# Altium schematic sheet Power.SchDoc
size A
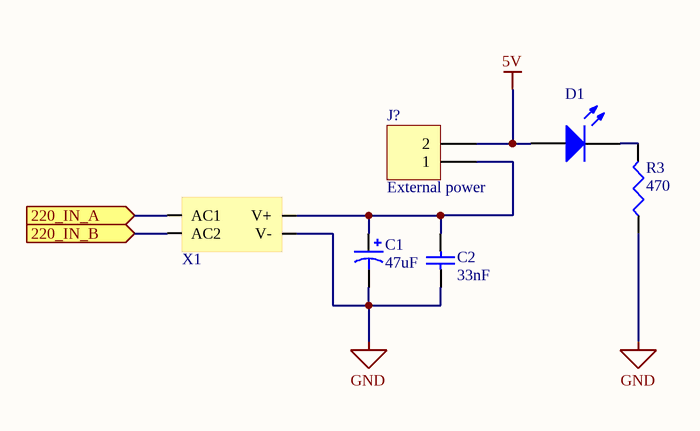
[diagram p0: Power.SchDoc]

## Parts
C1  value 47uF  [CAP47U]  (hidden comment: Cap Pol1)
C2  value 33nF  [C0805]  (hidden comment: Cap)
D1  LED2  [3.2X1.6X1.1]  (value not drawn)
J?  External power  [HEADER2]
R3  value 470  [J1-0603]  (hidden comment: Res3)
X1  AC/DC  [HLK-PM01]  (value not drawn)

## Ports
220_IN_A (in), 220_IN_B (in)

## Nets
5V: D1.1(A) J?.2
GND: C1.2 C2.1 R3.1 X1.3(V-)
220_IN_A: X1.1(AC1) ; port 220_IN_A
220_IN_B: X1.2(AC2) ; port 220_IN_B
NetC1_1: C1.1 C2.2 J?.1 X1.4(V+)
NetD1_2: D1.2(K) R3.2

## Library data of the parts
C1 = Cap Pol1: Polarized Capacitor (Radial); Manufacturer 1: Nichicon; Manufacturer Part Number 1: UWT1E470MCL6GS; Description 1: Aluminum Electrolytic Capacitors - SMD 25volts 47uF 6.3x5.8 20%; Dielectric Material: Aluminium; Voltage Rating: 25V; Tolerance: 20%; Ripple Current: 59mA; Leakage Current: 3uA; Life (Hours): 1000Hour; Dissipation Factor: 0.16%; Published: 8-Jun-2000; LatestRevisionDate: 17-Jul-2002; LatestRevisionNote: Re-released for DXP Platform.; PackageReference: RB7.6-15; Publisher: Altium Limited; PackageDescription: Polarized Capacitor (Radial); 2 Leads; Supplier 1: Digi-Key; Supplier Part Number 1: 493-9881-6-ND; Stock: 12722; Pricing 1: 1=0.29, 10=0.202, 100=0.1143, 500=0.08072 (USD); Mount: Surface Mount; Case/Package: Radial; Min Operating Temperature: -55°C; Max Operating Temperature: 105°C; Capacitance: 47uF; Package Quantity: 1000; Voltage Rating (DC): 25V; Packaging: Tape and Reel; Termination: SMD/SMT; Features: General Purpose; Diameter: 6.3mm; Length: 5.8mm; Height: 6.6mm; Radiation Hardening: No; Lead Free: Lead Free; ComponentLink1URL: http://www.mouser.com/ds/2/293/e-wt-30307.pdf?src-supplier=Mouser; ComponentLink1Description: http://www.mouser.com/ds/2/293/e-wt-30307.pdf?src-supplier=Mouser; ComponentLink2URL: https://www.verical.com/server-webapp/html/getDatasheet?partID=732041&src-supplier=Verical; ComponentLink2Description: https://www.verical.com/server-webapp/html/getDatasheet?partID=732041&src-supplier=Verical; ComponentLink3URL: http://www.nichicon.co.jp/english/products/pdfs/e-ch_ref.pdf?src-supplier=Digi-Key; ComponentLink3Description: http://www.nichicon.co.jp/english/products/pdfs/e-ch_ref.pdf?src-supplier=Digi-Key; ComponentLink4URL: http://nichicon-us.com/english/products/pdfs/e-wt.pdf?src-supplier=Future+Electronics; ComponentLink4Description: http://nichicon-us.com/english/products/pdfs/e-wt.pdf?src-supplier=Future+Electronics; ComponentLink5URL: http://www.nichicon.co.jp/english/products/pdfs/e-wt.pdf?src-supplier=Avnet+Europe; ComponentLink5Description: http://www.nichicon.co.jp/english/products/pdfs/e-wt.pdf?src-supplier=Avnet+Europe
C2 = Cap: Capacitor; Manufacturer 1: KEMET; Manufacturer Part Number 1: C0805C333K5RACTU; Description 1: KEMET - C0805C333K5RACTU - SMD Multilayer Ceramic Capacitor, 33000 pF, 50 V, 0805 [2012 Metric], ± 10%, X7R, C Series KEMET; Dielectric Material: Ceramic; Tolerance: 10%; Dielectric: X7R; Voltage Rating (DC): 50V; Published: 8-Jun-2000; LatestRevisionDate: 17-Jul-2002; LatestRevisionNote: Re-released for DXP Platform.; PackageReference: RAD-0.3; Publisher: Altium Limited; PackageDescription: Radial Cap, Thru-Hole; 2 Leads; 0.3 in Pin Spacing; Supplier 1: Digi-Key; Supplier Part Number 1: 399-1165-6-ND; Stock: 116403; Pricing 1: 1=0.12, 10=0.087, 100=0.0407, 500=0.02856, 1000=0.02364 (USD); Mount: Surface Mount; Case/Package: 0805; Min Operating Temperature: -55°C; Max Operating Temperature: 125°C; Capacitance: 33nF; Packaging: Tape and Reel; Voltage: 50V; Termination: SMD/SMT; Length: 2mm; Height: 0.78mm; Depth: 1.25mm; Radiation Hardening: No; ComponentLink1URL: http://www.kemet.com/kemet/web/homepage/kechome.nsf/vapubfiles/KEM_C1002_X7R_SMD.pdf/$file/KEM_C1002_X7R_SMD.pdf?src-supplier=Element14; ComponentLink1Description: http://www.kemet.com/kemet/web/homepage/kechome.nsf/vapubfiles/KEM_C1002_X7R_SMD.pdf/$file/KEM_C1002_X7R_SMD.pdf?src-supplier=Element14; ComponentLink2URL: http://www.onlinecomponents.com/productFiles/mf-KEM/kem_c1002_x7r_smd.pdf?src-supplier=Onlinecomponents.com; ComponentLink2Description: http://www.onlinecomponents.com/productFiles/mf-KEM/kem_c1002_x7r_smd.pdf?src-supplier=Onlinecomponents.com
D1 = LED2: Typical RED, GREEN, YELLOW, AMBER GaAs LED; Manufacturer 1: Stanley; Manufacturer Part Number 1: PG1101W-TR; Description 1: LED GREEN CLEAR 3216 SMD; Lens Style: Clear; Forward Voltage: 2.1V; Viewing Angle: 137°; Wavelength: 560nm; Luminous Intensity: 4.8mcd; Published: 8-Jun-2000; LatestRevisionDate: 17-Jul-2002; LatestRevisionNote: Re-released for DXP Platform.; PackageVersion: Feb-2002; PackageReference: 3.2X1.6X1.1; Publisher: Altium Limited; PackageDescription: SM LED; 2 Flat Leads; Supplier 1: Digi-Key; Supplier Part Number 1: 404-1046-6-ND; Stock: 64799; Pricing 1: 1=0.45, 10=0.316, 100=0.1841, 500=0.12624, 1000=0.1052 (USD); Mount: Surface Mount; Case/Package: 1206; Color: Green; Packaging: Cut Tape; Length: 3mm; Height: 1.5mm; Width: 1.5mm; Lead Free: Lead Free; ComponentLink1URL: http://www1.futureelectronics.com/doc/STANLEY/PG1101W-TR.pdf?src-supplier=Future+Electronics; ComponentLink1Description: http://www1.futureelectronics.com/doc/STANLEY/PG1101W-TR.pdf?src-supplier=Future+Electronics
J? = Header 2: Header, 2-Pin; Manufacturer 1: Amphenol FCI; Manufacturer Part Number 1: 77311-118-02LF; Description 1: Conn;  Rect;  UnshroudedHdr;  2Cnts;  ThruHole;  BergStik;  2.54mmPin-Spng;  Vert;  SingleRow; Current Rating: 3A; Voltage Rating: 1.5kV; Number of Positions: 2; Insulation Resistance: 5GR; Gender: Male; Connector Type: Male Pin; Pitch: 2.54mm; Contact Post Length: 3.05mm; LatestRevisionDate: 17-Jul-2002; LatestRevisionNote: Re-released for DXP Platform.; Publisher: Altium Limited; Supplier 1: Digi-Key; Supplier Part Number 1: 609-4434-ND; Stock: 85355; Pricing 1: 1=0.19, 10=0.182, 100=0.1258, 500=0.10648, 1000=0.08712, 5000=0.07744, 10000=0.07018 (USD); Mount: Through Hole; Contact Plating: Gold,GXT; Contact Material: Bronze; Color: Black; Housing Color: Black; Material: Thermoplastic; Housing Material: Thermoplastic; Min Operating Temperature: -65°C; Max Operating Temperature: 125°C; Number of Rows: 1; Contact Gender: Male; Package Quantity: 1000; Packaging: Bulk; Termination: Solder; Number of Contacts: 2; Max Voltage Rating (AC): 1.5kV; Orientation: Straight; Length: 5.08mm; Contact Mating Length: 0.23inch; Depth: 2.4mm; Radiation Hardening: No; REACH SVHC: No SVHC; Lead Free: Lead Free; Flammability Rating: UL94 V-0; ComponentLink1URL: https://cdn.amphenol-icc.com/media/wysiwyg/files/drawing/77311.pdf?src-supplier=Digi-Key; ComponentLink1Description: https://cdn.amphenol-icc.com/media/wysiwyg/files/drawing/77311.pdf?src-supplier=Digi-Key; ComponentLink2URL: http://portal.fciconnect.com/Comergent/fci/drawing/77311.pdf?src-supplier=Avnet+Asia; ComponentLink2Description: http://portal.fciconnect.com/Comergent/fci/drawing/77311.pdf?src-supplier=Avnet+Asia; ComponentLink3URL: http://portal.fciconnect.com/Comergent/fci/drawing/77311.pdf?src-supplier=Avnet; ComponentLink3Description: http://portal.fciconnect.com/Comergent/fci/drawing/77311.pdf?src-supplier=Avnet; ComponentLink4URL: https://www.alliedelec.com/m/d/695616ca3fa695a35268331f95f01020.pdf?src-supplier=Allied+Electronics; ComponentLink4Description: https://www.alliedelec.com/m/d/695616ca3fa695a35268331f95f01020.pdf?src-supplier=Allied+Electronics
R3 = Res3: Resistor; Manufacturer 1: TE Connectivity; Manufacturer Part Number 1: CRGCQ0603J470R; Description 1: TE CONNECTIVITY - CRGCQ0603J470R - RES, 470R, 5%, 0603, THICK FILM; Resistance: 470R; Tolerance: 5%; Max Power Dissipation: 100mW; Temperature Coefficient: 100ppm/°C; Published: 8-Jun-2000; LatestRevisionDate: 29-May-2009; LatestRevisionNote: IPC-7351 Footprint Added.; PackageReference: J1-0603; Publisher: Altium Limited; PackageDescription: Chip Resistor; Supplier 1: Digi-Key; Supplier Part Number 1: A130089DKR-ND; Stock: 87954; Pricing 1: 1=0.1, 10=0.021, 100=0.0086, 1000=0.00387, 2500=0.00336 (USD); Case/Package: 0603; Case Code (Imperial): 0603; Case Code (Metric): 1608; Min Operating Temperature: -55°C; Max Operating Temperature: 155°C; Composition: Thick Film; Features: Moisture Resistant,Automotive AEC-Q200; Packaging: Tape and Reel; Number of Terminations: 2; ComponentLink1URL: https://4donline.ihs.com/images/VipMasterIC/IC/TYEL/TYEL-S-A0004929575/TYEL-S-A0004929575-1.pdf?hkey=52A5661711E402568146F3353EA87419&src-supplier=Farnell; ComponentLink1Description: https://4donline.ihs.com/images/VipMasterIC/IC/TYEL/TYEL-S-A0004929575/TYEL-S-A0004929575-1.pdf?hkey=52A5661711E402568146F3353EA87419&src-supplier=Farnell; ComponentLink2URL: https://4donline.ihs.com/images/VipMasterIC/IC/TYEL/TYEL-S-A0004929575/TYEL-S-A0004929575-1.pdf?hkey=52A5661711E402568146F3353EA87419&src-supplier=Newark; ComponentLink2Description: https://4donline.ihs.com/images/VipMasterIC/IC/TYEL/TYEL-S-A0004929575/TYEL-S-A0004929575-1.pdf?hkey=52A5661711E402568146F3353EA87419&src-supplier=Newark; ComponentLink3URL: https://www.te.com/commerce/DocumentDelivery/DDEController?Action=srchrtrv&amp;DocNm=1773204-3&amp;DocType=DS&amp;DocLang=English&src-supplier=Digi-Key; ComponentLink3Description: https://www.te.com/commerce/DocumentDelivery/DDEController?Action=srchrtrv&amp;DocNm=1773204-3&amp;DocType=DS&amp;DocLang=English&src-supplier=Digi-Key; ComponentLink4URL: https://www.te.com/commerce/DocumentDelivery/DDEController?Action=srchrtrv&DocNm=1773204-3&DocType=DS&DocLang=English&src-supplier=Digi-Key; ComponentLink4Description: https://www.te.com/commerce/DocumentDelivery/DDEController?Action=srchrtrv&DocNm=1773204-3&DocType=DS&DocLang=English&src-supplier=Digi-Key
X1 = HLK-PM01: 220Vac to 5Vdc converter (3W)